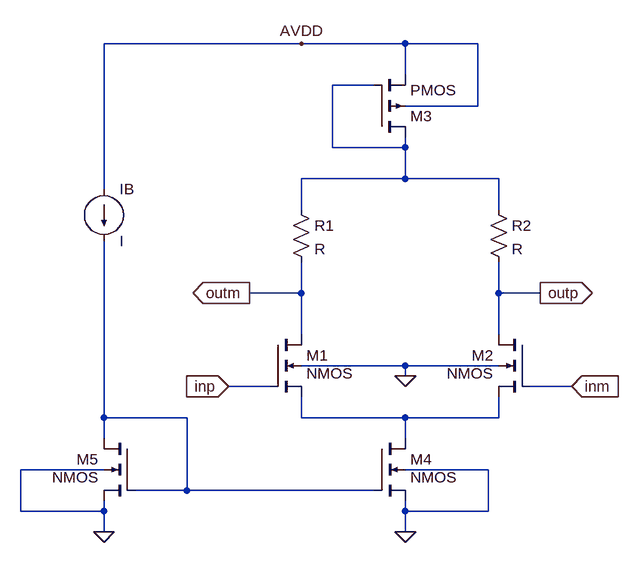
[diagram p0: schematic zc_dm_amp.asc]
zc_dm_amp.asc, the LTspice schematic file:
Version 4
SHEET 1 1464 708
WIRE 336 -224 32 -224
WIRE 496 -224 336 -224
WIRE 608 -224 496 -224
WIRE 496 -176 496 -224
WIRE 448 -160 384 -160
WIRE 608 -128 608 -224
WIRE 608 -128 496 -128
WIRE 384 -64 384 -160
WIRE 496 -64 496 -80
WIRE 496 -64 384 -64
WIRE 496 -16 496 -64
WIRE 496 -16 336 -16
WIRE 640 -16 496 -16
WIRE 32 0 32 -224
WIRE 336 32 336 -16
WIRE 640 32 640 -16
WIRE 336 160 336 112
WIRE 336 160 256 160
WIRE 640 160 640 112
WIRE 704 160 640 160
WIRE 336 224 336 160
WIRE 640 224 640 160
WIRE 496 272 336 272
WIRE 640 272 496 272
WIRE 496 288 496 272
WIRE 288 304 224 304
WIRE 752 304 688 304
WIRE 32 352 32 80
WIRE 160 352 32 352
WIRE 336 352 336 320
WIRE 496 352 336 352
WIRE 640 352 640 320
WIRE 640 352 496 352
WIRE 32 384 32 352
WIRE 496 384 496 352
WIRE 32 432 -96 432
WIRE 624 432 496 432
WIRE 160 464 160 352
WIRE 160 464 80 464
WIRE 448 464 160 464
WIRE -96 496 -96 432
WIRE 32 496 32 480
WIRE 32 496 -96 496
WIRE 496 496 496 480
WIRE 624 496 624 432
WIRE 624 496 496 496
WIRE 32 528 32 496
WIRE 496 528 496 496
FLAG 496 528 0
FLAG 224 304 inp
IOPIN 224 304 In
FLAG 704 160 outp
IOPIN 704 160 Out
FLAG 256 160 outm
IOPIN 256 160 Out
FLAG 752 304 inm
IOPIN 752 304 In
FLAG 496 288 0
FLAG 336 -224 AVDD
FLAG 32 528 0
SYMBOL nmos4 288 224 R0
WINDOW 3 56 60 Left 2
SYMATTR InstName M1
SYMBOL pmos4 448 -80 M180
SYMATTR InstName M3
SYMBOL nmos4 688 224 M0
WINDOW 3 56 60 Left 2
SYMATTR InstName M2
SYMBOL nmos4 448 384 R0
WINDOW 3 56 60 Left 2
SYMATTR InstName M4
SYMBOL res 624 16 R0
SYMATTR InstName R2
SYMBOL res 320 16 R0
SYMATTR InstName R1
SYMBOL nmos4 80 384 M0
WINDOW 3 56 60 Left 2
SYMATTR InstName M5
SYMBOL current 32 0 R0
SYMATTR InstName IB

The netlist it stands for:
* zc_dm_amp.asc
M1 outm inp N003 0 NMOS
M3 N001 N001 AVDD AVDD PMOS
M2 outp inm N003 0 NMOS
M4 N003 N002 0 0 NMOS
R2 N001 outp R
R1 N001 outm R
M5 N002 N002 0 0 NMOS
IB AVDD N002 I
.model NMOS NMOS
.model PMOS PMOS
.lib standard.mos
.backanno
.end